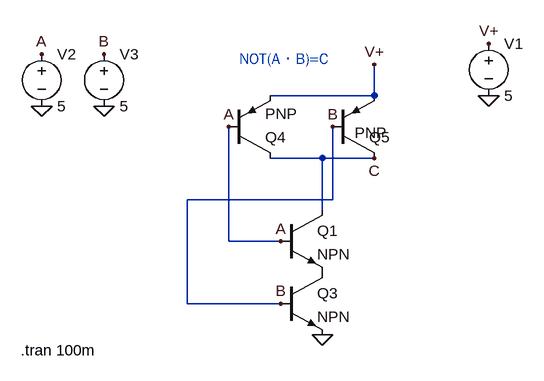
[diagram p0: schematic R4.11.17TTL_NAND.asc]
R4.11.17TTL_NAND.asc, the LTspice schematic file:
Version 4
SHEET 1 880 680
WIRE 208 -128 208 -176
WIRE 208 -128 48 -128
WIRE 128 -32 48 -32
WIRE 208 -32 128 -32
WIRE 144 32 144 -80
WIRE 144 32 -80 32
WIRE 128 48 128 -32
WIRE -16 96 -16 -80
WIRE 64 96 -16 96
WIRE -80 192 -80 32
WIRE 64 192 -80 192
FLAG 208 -176 V+
FLAG 128 240 0
FLAG -16 -80 A
FLAG 64 96 A
FLAG 144 -80 B
FLAG 208 -32 C
FLAG 64 192 B
FLAG 384 -208 V+
FLAG 384 -128 0
FLAG -304 -192 A
FLAG -208 -192 B
FLAG -208 -112 0
FLAG -304 -112 0
SYMBOL npn 64 48 R0
SYMATTR InstName Q1
SYMBOL npn 64 144 R0
SYMATTR InstName Q3
SYMBOL pnp -16 -32 M180
SYMATTR InstName Q4
SYMBOL pnp 144 -32 M180
WINDOW 3 34 39 Left 2
SYMATTR InstName Q5
SYMBOL voltage 384 -224 R0
WINDOW 123 0 0 Left 0
WINDOW 39 0 0 Left 0
SYMATTR InstName V1
SYMATTR Value 5
SYMBOL voltage -304 -208 R0
WINDOW 123 0 0 Left 0
WINDOW 39 0 0 Left 0
SYMATTR InstName V2
SYMATTR Value 5
SYMBOL voltage -208 -208 R0
WINDOW 123 0 0 Left 0
WINDOW 39 0 0 Left 0
SYMATTR InstName V3
SYMATTR Value 5
TEXT -336 264 Left 2 !.tran 100m
TEXT 0 -184 Left 2 ;NOT(A・B)=C

The netlist it stands for:
* R4.11.17TTL_NAND.asc
Q1 C A P001 0 NPN
Q3 P001 B 0 0 NPN
Q4 C A V+ 0 PNP
Q5 C B V+ 0 PNP
V1 V+ 0 5
V2 A 0 5
V3 B 0 5
.model NPN NPN
.model PNP PNP
.lib standard.bjt
.tran 100m
* NOT(A・B)=C
.backanno
.end